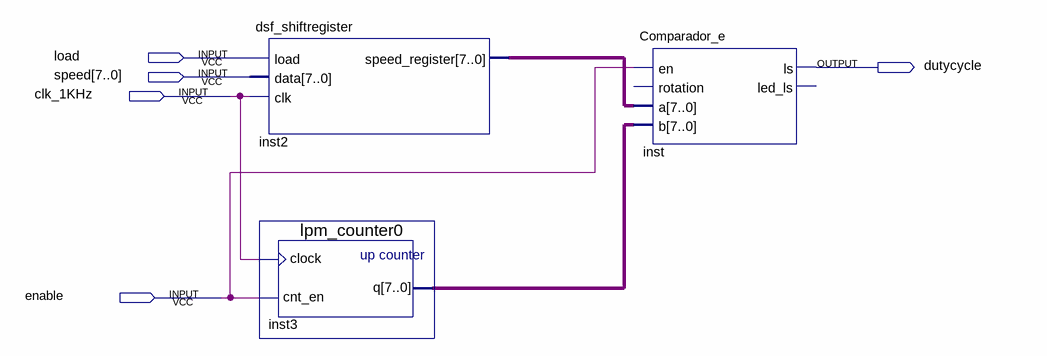
[diagram p0: schematic sheet]
// Quartus schematic pwm.bdf as structural Verilog: 3 symbols, 5 pins
module pwm (
  input  load,
  input  [7:0] speed,
  input  clk_1KHz,
  input  enable,
  output dutycycle
);

  wire [7:0] inst2_speed_register, inst3_q;

  dsf_shiftregister inst2 (.load(load), .data(speed), .clk(clk_1KHz), .speed_register(inst2_speed_register));
  lpm_counter0 inst3 (.clock(clk_1KHz), .cnt_en(enable), .q(inst3_q));
  Comparador_e inst (.en(enable), .a(inst2_speed_register), .b(inst3_q), .ls(dutycycle));  // open: rotation, led_ls
endmodule
